# EAGLE design ruido (EAGLE 9.2.2)
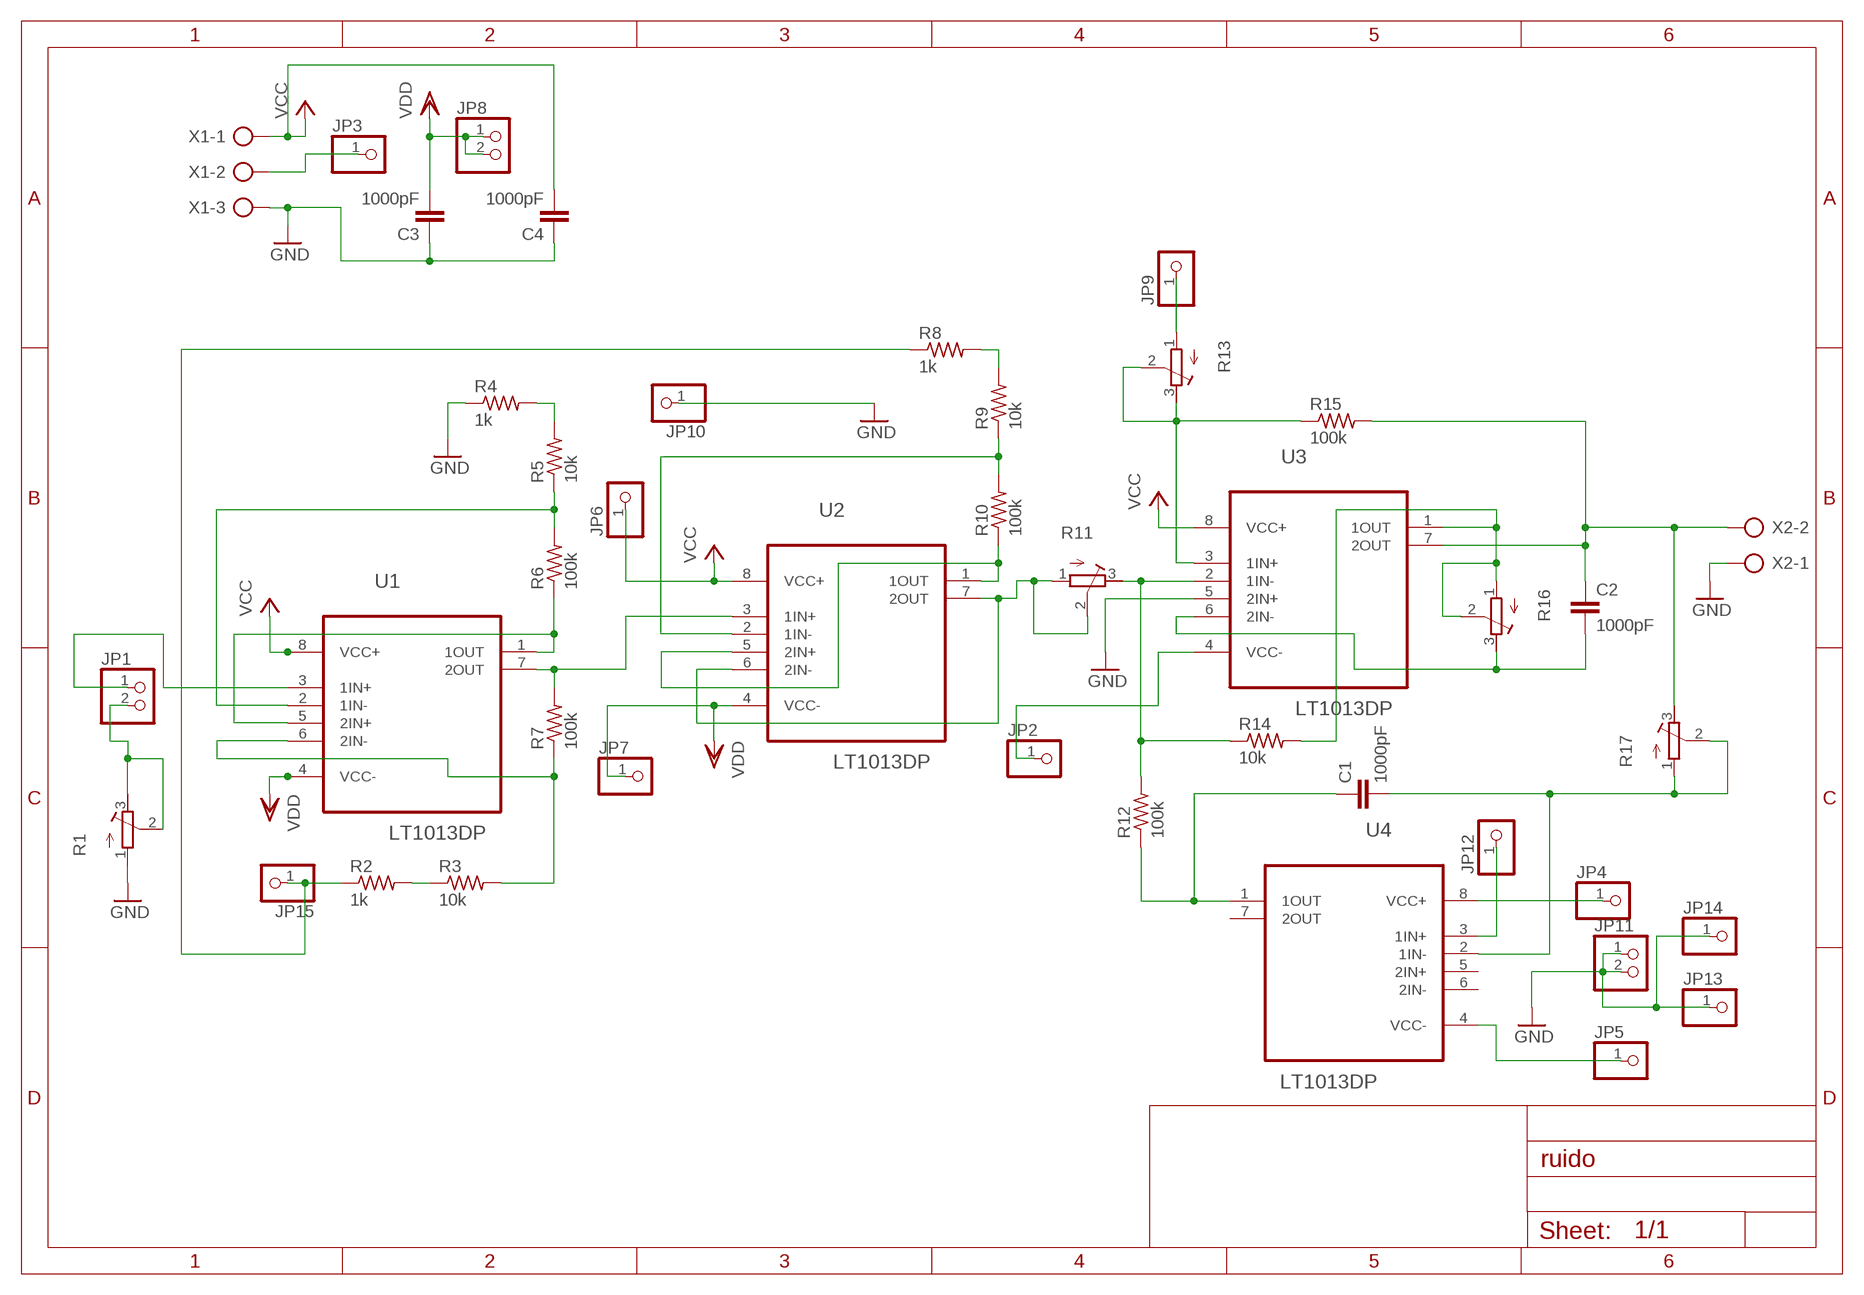
[diagram p0: schematic, sheet 1]

## Parts
C1  1000pF  C-EU050-024X044  [C050-024X044]
C2  1000pF  C-EU050-024X044  [C050-024X044]
C3  1000pF  C-EU050-024X044  [C050-024X044]
C4  1000pF  C-EU050-024X044  [C050-024X044]
JP1  PINHD-1X2  [1X02]
JP2  PINHD-1X1  [1X01]
JP3  PINHD-1X1  [1X01]
JP4  PINHD-1X1  [1X01]
JP5  PINHD-1X1  [1X01]
JP6  PINHD-1X1  [1X01]
JP7  PINHD-1X1  [1X01]
JP8  PINHD-1X2  [1X02]
JP9  PINHD-1X1  [1X01]
JP10  PINHD-1X1  [1X01]
JP11  PINHD-1X2  [1X02]
JP12  PINHD-1X1  [1X01]
JP13  PINHD-1X1  [1X01]
JP14  PINHD-1X1  [1X01]
JP15  PINHD-1X1  [1X01]
R1  R-TRIMM3296W  [RTRIM3296W]
R2  1k  R-US_0207/10  [0207/10]
R3  10k  R-US_0207/10  [0207/10]
R4  1k  R-US_0207/10  [0207/10]
R5  10k  R-US_0207/10  [0207/10]
R6  100k  R-US_0207/10  [0207/10]
R7  100k  R-US_0207/10  [0207/10]
R8  1k  R-US_0207/10  [0207/10]
R9  10k  R-US_0207/10  [0207/10]
R10  100k  R-US_0207/10  [0207/10]
R11  R-TRIMM3296W  [RTRIM3296W]
R12  100k  R-US_0207/10  [0207/10]
R13  R-TRIMM3296W  [RTRIM3296W]
R14  10k  R-US_0207/10  [0207/10]
R15  100k  R-US_0207/10  [0207/10]
R16  R-TRIMM3296W  [RTRIM3296W]
R17  R-TRIMM3296W  [RTRIM3296W]
U1  LT1013DP  [DIP254P762X508-8]
U2  LT1013DP  [DIP254P762X508-8]
U3  LT1013DP  [DIP254P762X508-8]
U4  LT1013DP  [DIP254P762X508-8]
X1  AK500/3  [AK500/3]
X2  AK500/2  [AK500/2]

## Nets
GND: C3.1 C4.1 JP10.1 JP11.1 JP11.2 JP13.1 JP14.1 R1.1(A) R4.1 U3.5(2IN+) X1.3 X2.1
N$1: R6.1 U1.1(1OUT) U1.5(2IN+)
N$2: R5.1 R6.2 U1.2(1IN-)
N$3: R4.2 R5.2
N$4: R7.2 U1.7(2OUT) U2.3(1IN+)
N$5: R3.2 R7.1 U1.6(2IN-)
N$6: R2.2 R3.1
N$7: R10.1 U2.1(1OUT) U2.5(2IN+)
N$8: R9.1 R10.2 U2.2(1IN-)
N$9: R8.2 R9.2
N$10: R13.2(S) R13.3(E) R15.1 U3.3(1IN+)
N$11: R11.1(A) R11.2(S) U2.6(2IN-) U2.7(2OUT)
N$12: R14.2 R16.1(A) R16.2(S) U3.1(1OUT)
N$13: R11.3(E) R12.2 R14.1 U3.2(1IN-)
N$14: C2.2 R16.3(E) U3.6(2IN-)
N$15: C2.1 R15.2 R17.3(E) U3.7(2OUT) X2.2
N$16: C1.1 R12.1 U4.1(1OUT)
N$17: C1.2 R17.1(A) R17.2(S) U4.2(1IN-)
N$18: JP1.2 R1.2(S) R1.3(E)
N$19: JP1.1 U1.3(1IN+)
N$20: JP5.1 U4.4(VCC-)
N$21: JP4.1 U4.8(VCC+)
N$22: JP9.1 R13.1(A)
N$23: JP2.1 U3.4(VCC-)
N$24: JP3.1 X1.2
N$25: JP12.1 U4.3(1IN+)
N$26: JP15.1 R2.1 R8.1
VCC: C4.2 JP6.1 U1.8(VCC+) U2.8(VCC+) U3.8(VCC+) X1.1
VDD: C3.2 JP7.1 JP8.1 JP8.2 U1.4(VCC-) U2.4(VCC-)
Unconnected: U4.5(2IN+) U4.6(2IN-) U4.7(2OUT)

## Library data of the parts
C1-C4 = rcl:C-EU: CAPACITOR, European symbol; SPICEPREFIX: C
JP1 JP8 JP11 = pinhead:PINHD-1X2: PIN HEADER
JP2-JP7 JP9 JP10 JP12-JP15 = pinhead:PINHD-1X1: PIN HEADER
R1 R11 R13 R16 R17 = rcl:R-TRIMM: Trimm resistor; SPICEMODEL: X; SPICEPREFIXL: POT
R2-R5 R7-R10 R12 R14 R15 = rcl:R-US_: RESISTOR, American symbol; SPICEPREFIX: R
R6 = rcl:R-US_: RESISTOR, American symbol; SPICEPREFIX: 100k
U1-U4 = LT1013DP:LT1013DP: OPERATIONAL AMPLIFIER; AVAILABILITY: Unavailable; DESCRIPTION: Dual Precision Operational Amplifier 8-PDIP 0 to 70; MF: Texas Instruments; MP: LT1013DP; PACKAGE: PDIP-8 Texas Instruments; PRICE: None
X1 = con-ptr500:AK500/3: CONNECTOR; OC_FARNELL: unknown; OC_NEWARK: unknown
X2 = con-ptr500:AK500/2: CONNECTOR; OC_FARNELL: unknown; OC_NEWARK: unknown

## Board
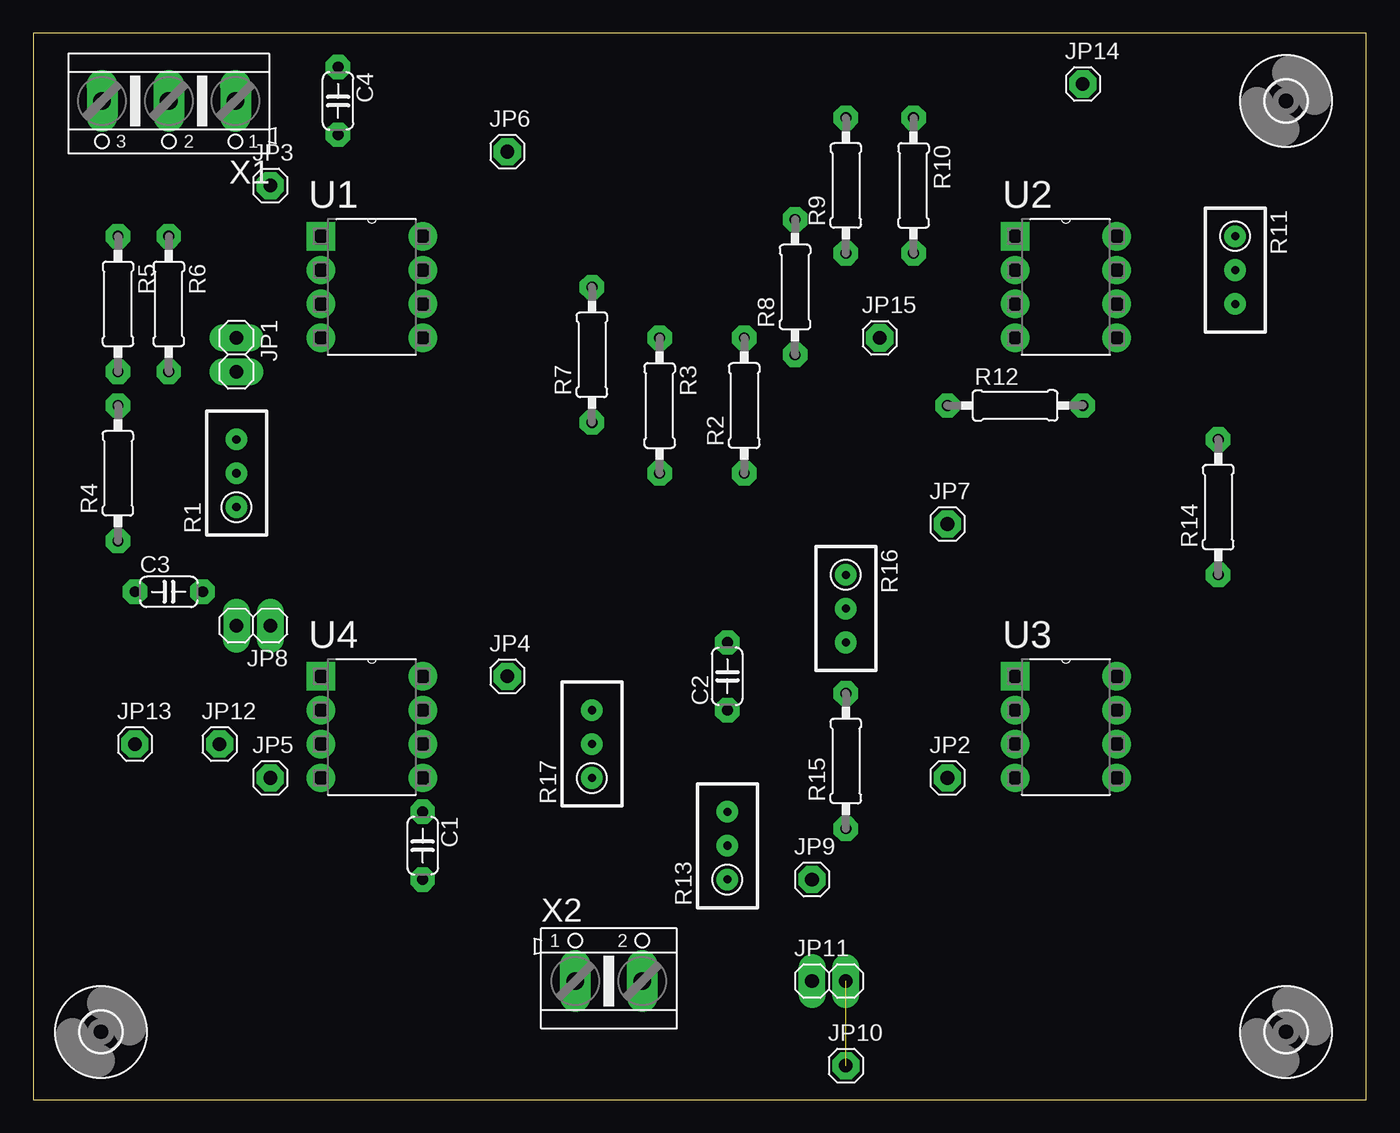
[diagram p1: board, top side]
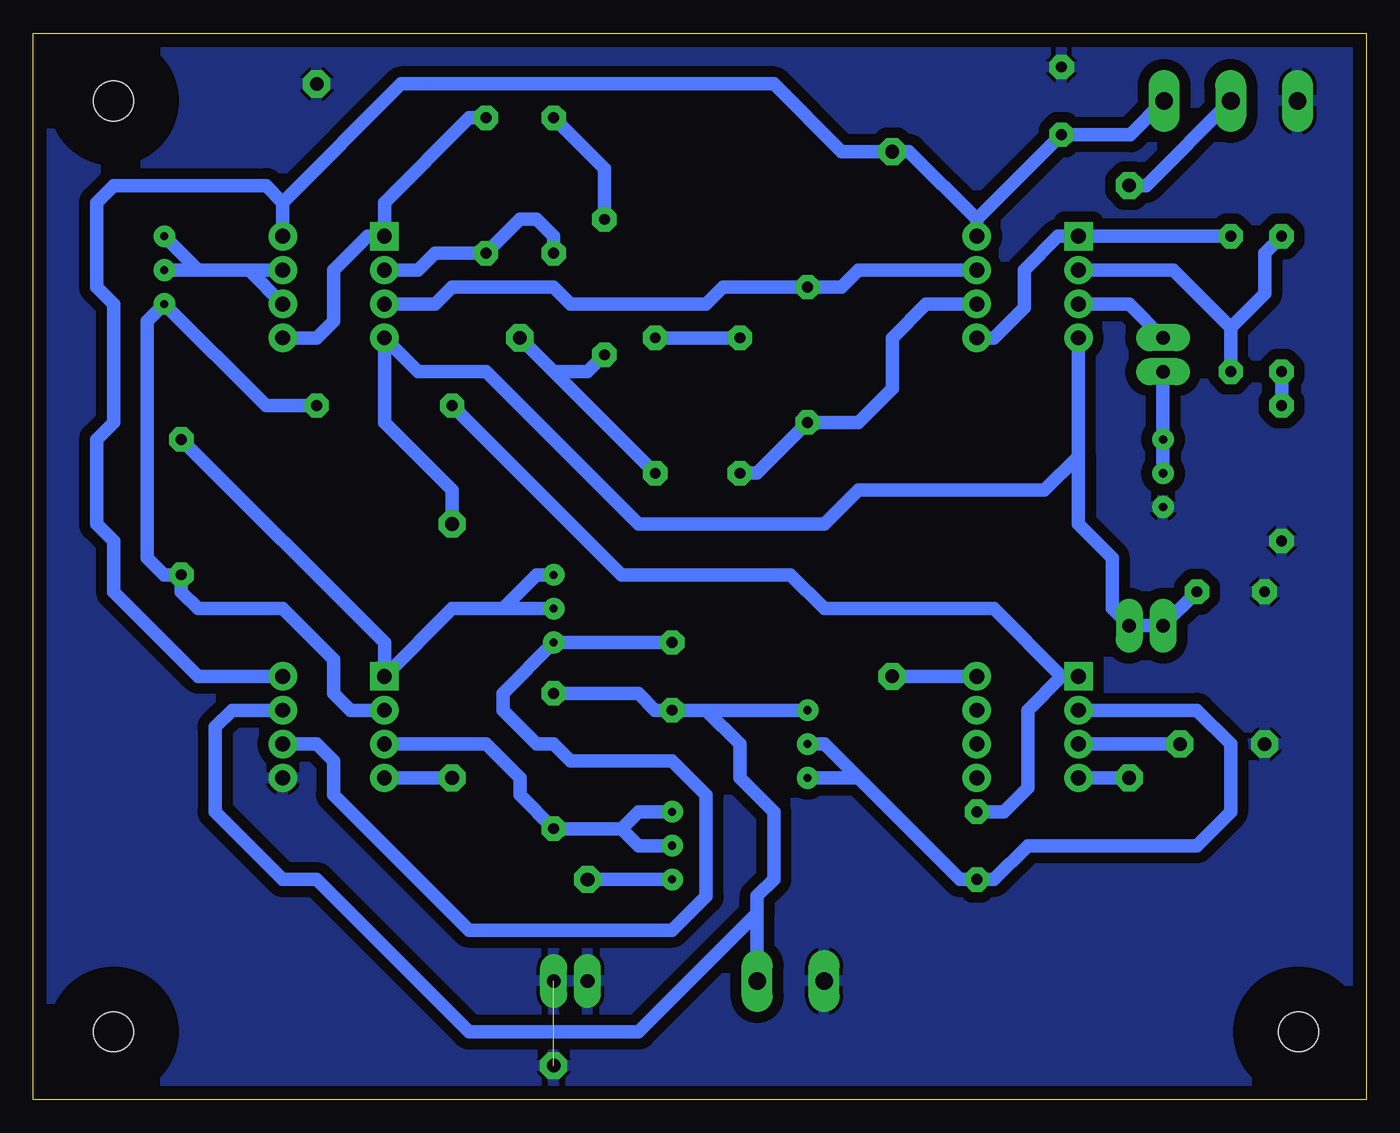
[diagram p2: board, bottom side, seen from below]

Size 100 x 80 mm. Coordinates in mm from the lower left corner, seen from the top.
Outline: 0,0 100,0 100,80 0,80 0,0
Copper layers (1*16): Top 0.035mm / dielectric 1.5mm / Bottom 0.035mm
Design rules "default *": minimum track width 6mil, minimum drill 0.35mm, track to track 6mil, track to pad 6mil, pad to pad 6mil, via to via 6mil, smd to smd 6mil, copper to edge 40mil, drill to drill 6mil, minimum pad ring 20mil, minimum via ring 8mil, stop-mask expansion 4mil, vias tented up to drill 0mil, thermal gap 10mil

### Footprints (pad centres in the part's own frame; a part is rotated, then mirrored left to right if it is on the bottom)
C050-024X044 = drill 0.813 octagon: 1 -2.54,0; 2 2.54,0
1X02 = drill 1.016 long: 1 -1.27,0; 2 1.27,0
1X01 = drill 1.016 octagon: 1 0,0
RTRIM3296W = drill 0.61: 1 0,-2.54; 2 0,0; 3 0,2.54
0207/10 = drill 0.813 octagon: 1 -5.08,0; 2 5.08,0
DIP254P762X508-8 = drill 1.118 square: 1 -7.62,7.62 | drill 1.118: 2 -7.62,5.08; 3 -7.62,2.54; 4 -7.62,0; 5 0,0; 6 0,2.54; 7 0,5.08; 8 0,7.62
3,0 = hole 3: 0,0
AK500/3 = drill 1.321 long: 1 -5.004,0; 2 0,0; 3 5.004,0
AK500/2 = drill 1.321 long: 1 -2.515,0; 2 2.515,0

### Placement (x,y rotation side)
C1  29.21,19.05 270 top
C2  52.07,31.75 90 top
C3  10.16,38.1 0 top
C4  22.86,74.93 270 top
JP1  15.24,55.88 270 top
JP2  68.58,24.13 0 top
JP3  17.78,68.58 0 top
JP4  35.56,31.75 0 top
JP5  17.78,24.13 0 top
JP6  35.56,71.12 0 top
JP7  68.58,43.18 0 top
JP8  16.51,35.56 180 top
JP9  58.42,16.51 0 top
JP10  60.96,2.54 0 top
JP11  59.69,8.89 0 top
JP12  13.97,26.67 0 top
JP13  7.62,26.67 0 top
JP14  78.74,76.2 0 top
JP15  63.5,57.15 0 top
R1  15.24,46.99 0 top
R2  53.34,52.07 90 top
R3  46.99,52.07 270 top
R4  6.35,46.99 90 top
R5  6.35,59.69 270 top
R6  10.16,59.69 270 top
R7  41.91,55.88 90 top
R8  57.15,60.96 90 top
R9  60.96,68.58 90 top
R10  66.04,68.58 270 top
R11  90.17,62.23 180 top
R12  73.66,52.07 0 top
R13  52.07,19.05 0 top
R14  88.9,44.45 90 top
R15  60.96,25.4 90 top
R16  60.96,36.83 180 top
R17  41.91,26.67 0 top
U1  29.21,57.15 0 top
U2  81.28,57.15 0 top
U3  81.28,24.13 0 top
U4  29.21,24.13 0 top
U$1  [3,0]  93.98,74.93 0 top
U$2  [3,0]  93.98,5.08 0 top
U$3  [3,0]  5.08,5.08 0 top
X1  10.16,74.93 180 top
X2  43.18,8.89 0 top

### Tracks (layer width: path | path; a pad name or v marks a point on that pad's centre or on a via)
GND  (1 unrouted)
  pour Bottom (isolate 0.813): -3.81,83.82 101.6,83.82 101.6,-1.27 -2.54,-1.27 -3.81,-1.27
N$1
  Bottom 1.016: U1.5 27.94,57.15 25.65,59.44 25.65,62.23 23.11,64.77 U1.1 R6.1
N$2
  Bottom 1.016: R6.2 10.16,57.91 | U1.2 14.48,62.23 10.16,57.91 | R5.1 7.62,63.5 7.62,60.45 10.16,57.91
N$3
  Bottom 1.016: R5.2 R4.2
N$4
  Bottom 1.016: U1.7 38.1,62.23 39.37,60.96 R7.2 48.26,60.96 49.53,59.69 59.69,59.69 60.96,60.96 68.58,60.96 69.85,59.69 U2.3
N$5
  Bottom 1.016: U1.6 33.02,59.69 35.56,57.15 35.56,53.34 38.1,50.8 R7.1 45.72,46.99 R3.2
N$6
  Bottom 1.016: R3.1 R2.2
N$7
  Bottom 1.016: R10.1 67.31,73.66 73.66,67.31 U2.1 74.93,64.77 77.47,62.23 77.47,58.42 78.74,57.15 U2.5
N$8
  Bottom 1.016: U2.2 71.12,62.23 69.85,63.5 R10.2 63.5,66.04 62.23,66.04 60.96,64.77 R9.1
N$9
  Bottom 1.016: R8.2 57.15,69.85 R9.2
N$10
  Bottom 1.016: R13.3 54.61,21.59 55.88,20.32 | 55.88,20.32 R15.1 63.5,22.86 63.5,24.13 66.04,26.67 U3.3 | R13.2 54.61,19.05 55.88,20.32
N$11
  Bottom 1.016: U2.7 83.82,62.23 | 83.82,62.23 87.63,62.23 | 87.63,62.23 R11.2 | R11.1 87.63,62.23 | U2.6 83.82,62.23
N$12
  Bottom 1.016: R16.2 64.77,36.83 | 64.77,36.83 68.58,36.83 U3.1 73.66,34.29 R14.2 | R16.1 62.23,39.37 64.77,36.83
N$13
  Bottom 1.016: R12.2 82.55,52.07 R11.3 91.44,58.42 91.44,40.64 90.17,39.37 R14.1 88.9,38.1 87.63,36.83 81.28,36.83 77.47,33.02 77.47,30.48 76.2,29.21 U3.2
N$14
  Bottom 1.016: C2.2 R16.3 64.77,30.48 64.77,29.21 62.23,26.67 60.96,26.67 59.69,25.4 52.07,25.4 49.53,22.86 49.53,15.24 52.07,12.7 67.31,12.7 77.47,22.86 77.47,25.4 78.74,26.67 U3.6
N$15
  Bottom 1.016: R15.2 54.61,30.48 53.34,29.21 C2.1 49.53,29.21 | 49.53,29.21 R17.3 | X2.2 45.7,13.97 | 45.7,13.97 45.7,15.27 44.45,16.51 44.45,21.59 46.99,24.13 46.99,26.67 49.53,29.21 | U3.7 85.09,29.21 86.36,27.94 86.36,21.59 81.28,16.51 78.74,16.51 67.31,5.08 54.59,5.08 45.7,13.97
N$16
  Bottom 1.016: C1.1 27.18,21.59 25.4,23.37 25.4,29.21 22.86,31.75 | R12.1 55.88,39.37 43.18,39.37 40.64,36.83 27.94,36.83 22.86,31.75 | U4.1 22.86,31.75
N$17
  Bottom 1.016: R17.1 38.1,24.13 | 38.1,24.13 30.48,16.51 C1.2 27.94,16.51 25.4,19.05 12.7,19.05 10.16,21.59 10.16,26.67 12.7,29.21 U4.2 | R17.2 40.64,26.67 38.1,24.13
N$18
  Bottom 1.016: JP1.2 R1.3 R1.2
N$19
  Bottom 1.016: JP1.1 17.78,59.69 U1.3
N$20
  Bottom 1.016: JP5.1 U4.4
N$21
  Bottom 1.016: U4.8 JP4.1
N$22
  Bottom 1.016: R13.1 JP9.1
N$23
  Bottom 1.016: JP2.1 U3.4
N$24
  Bottom 1.016: X1.2 16.51,68.58 JP3.1
N$25
  Bottom 1.016: JP12.1 U4.3
N$26
  Bottom 1.016: JP15.1 60.96,54.61 | 60.96,54.61 R2.1 | R8.1 58.42,54.61 60.96,54.61
VCC
  Bottom 1.016: X1.1 17.7,72.39 C4.2 29.21,66.04 | 29.21,66.04 U1.8 | 29.21,66.04 34.29,71.12 JP6.1 39.37,71.12 44.45,76.2 72.39,76.2 81.28,67.31 | 81.28,67.31 U2.8 | U3.8 87.63,31.75 93.98,38.1 93.98,41.91 95.25,43.18 95.25,49.53 93.98,50.8 93.98,59.69 95.25,60.96 95.25,67.31 93.98,68.58 82.55,68.58 81.28,67.31
VDD
  Bottom 1.016: 21.59,48.26 21.59,43.18 19.05,40.64 19.05,36.83 JP8.1 JP8.2 C3.2 | 21.59,48.26 U1.4 | JP7.1 68.58,45.72 73.66,50.8 U2.4 71.12,54.61 66.04,54.61 54.61,43.18 40.64,43.18 38.1,45.72 24.13,45.72 21.59,48.26